# Altium project S12642_0404_etap2.PrjPcb
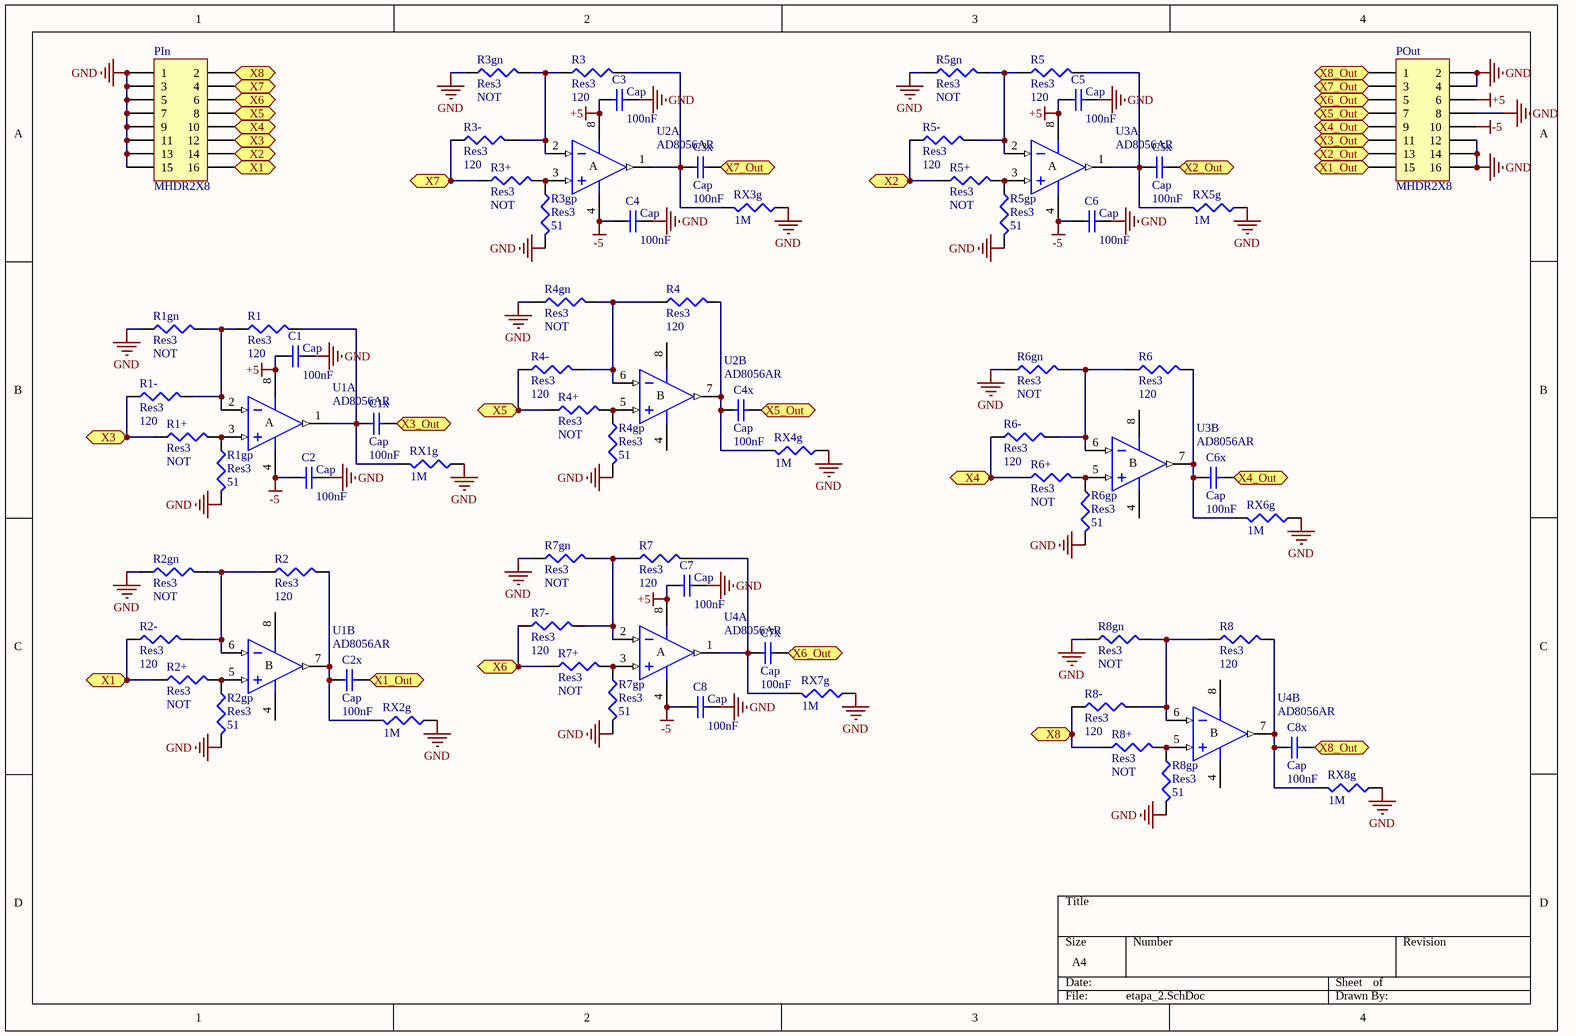
[diagram p0: etapa_2.SchDoc]
1 sheet, 70 parts. Net scope: flat (ports and power ports of the same name join across sheets).
Board file: etapa_2.PcbDoc

## Sheet etapa_2.SchDoc
size A4

### Parts
C1  Cap  value 100nF  [1608[0603]]
C1x  Cap  value 100nF  [1608[0603]]
C2  Cap  value 100nF  [1608[0603]]
C2x  Cap  value 100nF  [1608[0603]]
C3  Cap  value 100nF  [1608[0603]]
C3x  Cap  value 100nF  [1608[0603]]
C4  Cap  value 100nF  [1608[0603]]
C4x  Cap  value 100nF  [1608[0603]]
C5  Cap  value 100nF  [1608[0603]]
C5x  Cap  value 100nF  [1608[0603]]
C6  Cap  value 100nF  [1608[0603]]
C6x  Cap  value 100nF  [1608[0603]]
C7  Cap  value 100nF  [1608[0603]]
C7x  Cap  value 100nF  [1608[0603]]
C8  Cap  value 100nF  [1608[0603]]
C8x  Cap  value 100nF  [1608[0603]]
PIn  MHDR2X8  [MHDR2X8]
POut  MHDR2X8  [MHDR2X8]
R1  Res3  value 120  [0402]
R1+  Res3  value NOT  [0402]
R1-  Res3  value 120  [0402]
R1gn  Res3  value NOT  [0402]
R1gp  Res3  value 51  [0402]
R2  Res3  value 120  [0402]
R2+  Res3  value NOT  [0402]
R2-  Res3  value 120  [0402]
R2gn  Res3  value NOT  [0402]
R2gp  Res3  value 51  [0402]
R3  Res3  value 120  [0402]
R3+  Res3  value NOT  [0402]
R3-  Res3  value 120  [0402]
R3gn  Res3  value NOT  [0402]
R3gp  Res3  value 51  [0402]
R4  Res3  value 120  [0402]
R4+  Res3  value NOT  [0402]
R4-  Res3  value 120  [0402]
R4gn  Res3  value NOT  [0402]
R4gp  Res3  value 51  [0402]
R5  Res3  value 120  [0402]
R5+  Res3  value NOT  [0402]
R5-  Res3  value 120  [0402]
R5gn  Res3  value NOT  [0402]
R5gp  Res3  value 51  [0402]
R6  Res3  value 120  [0402]
R6+  Res3  value NOT  [0402]
R6-  Res3  value 120  [0402]
R6gn  Res3  value NOT  [0402]
R6gp  Res3  value 51  [0402]
R7  Res3  value 120  [0402]
R7+  Res3  value NOT  [0402]
R7-  Res3  value 120  [0402]
R7gn  Res3  value NOT  [0402]
R7gp  Res3  value 51  [0402]
R8  Res3  value 120  [0402]
R8+  Res3  value NOT  [0402]
R8-  Res3  value 120  [0402]
R8gn  Res3  value NOT  [0402]
R8gp  Res3  value 51  [0402]
RX1g  value 1M  [J1-0603]  (hidden comment: Res3)
RX2g  value 1M  [J1-0603]  (hidden comment: Res3)
RX3g  value 1M  [J1-0603]  (hidden comment: Res3)
RX4g  value 1M  [J1-0603]  (hidden comment: Res3)
RX5g  value 1M  [J1-0603]  (hidden comment: Res3)
RX6g  value 1M  [J1-0603]  (hidden comment: Res3)
RX7g  value 1M  [J1-0603]  (hidden comment: Res3)
RX8g  value 1M  [J1-0603]  (hidden comment: Res3)
U1  AD8056AR  [SO-8_M]  (parts A,B of 2)
U2  AD8056AR  [SO-8_M]  (parts A,B of 2)
U3  AD8056AR  [SO-8_M]  (parts A,B of 2)
U4  AD8056AR  [SO-8_M]  (parts A,B of 2)

### Ports
X1 (in), X1 (out), X1_Out (out), X2 (in), X2 (out), X2_Out (out), X3 (in), X3 (out), X3_Out (out), X4 (in), X4 (out), X4_Out (out), X5 (in), X5 (out), X5_Out (out), X6 (in), X6 (out), X6_Out (out), X7 (in), X7 (out), X7_Out (out), X8 (in), X8 (out), X8_Out (out)

### Nets
+5: C1.2 C3.2 C5.2 C7.2 POut.6 U1.8(V+) U2.8(V+) U3.8(V+) U4.8(V+)
-5: C2.2 C4.2 C6.2 C8.2 POut.10 U1.4(V-) U2.4(V-) U3.4(V-) U4.4(V-)
GND: C1.1 C2.1 C3.1 C4.1 C5.1 C6.1 C7.1 C8.1 PIn.1 PIn.3 PIn.5 PIn.7 PIn.9 PIn.11 PIn.13 PIn.15 POut.2 POut.4 POut.8 POut.12 POut.14 POut.16 R1gn.1 R1gp.2 R2gn.1 R2gp.2 R3gn.1 R3gp.2 R4gn.1 R4gp.2 R5gn.1 R5gp.2 R6gn.1 R6gp.2 R7gn.1 R7gp.2 R8gn.1 R8gp.2 RX1g.1 RX2g.1 RX3g.1 RX4g.1 RX5g.1 RX6g.1 RX7g.1 RX8g.1
NetC1x_1: C1x.1 R1.2 RX1g.2 U1.1(OUT)
NetC1x_2: C1x.2 POut.11 ; port X3_Out
NetC2x_1: C2x.1 R2.2 RX2g.2 U1.7(OUT)
NetC2x_2: C2x.2 POut.15 ; port X1_Out
NetC3x_1: C3x.1 R3.2 RX3g.2 U2.1(OUT)
NetC3x_2: C3x.2 POut.3 ; port X7_Out
NetC4x_1: C4x.1 R4.2 RX4g.2 U2.7(OUT)
NetC4x_2: C4x.2 POut.7 ; port X5_Out
NetC5x_1: C5x.1 R5.2 RX5g.2 U3.1(OUT)
NetC5x_2: C5x.2 POut.13 ; port X2_Out
NetC6x_1: C6x.1 R6.2 RX6g.2 U3.7(OUT)
NetC6x_2: C6x.2 POut.9 ; port X4_Out
NetC7x_1: C7x.1 R7.2 RX7g.2 U4.1(OUT)
NetC7x_2: C7x.2 POut.5 ; port X6_Out
NetC8x_1: C8x.1 R8.2 RX8g.2 U4.7(OUT)
NetC8x_2: C8x.2 POut.1 ; port X8_Out
NetPIn_2: PIn.2 R8+.1 R8-.1 ; port X8
NetPIn_4: PIn.4 R3+.1 R3-.1 ; port X7
NetPIn_6: PIn.6 R7+.1 R7-.1 ; port X6
NetPIn_8: PIn.8 R4+.1 R4-.1 ; port X5
NetPIn_10: PIn.10 R6+.1 R6-.1 ; port X4
NetPIn_12: PIn.12 R1+.1 R1-.1 ; port X3
NetPIn_14: PIn.14 R5+.1 R5-.1 ; port X2
NetPIn_16: PIn.16 R2+.1 R2-.1 ; port X1
NetR1+_2: R1+.2 R1gp.1 U1.3(IN+)
NetR1_1: R1.1 R1-.2 R1gn.2 U1.2(IN-)
NetR2+_2: R2+.2 R2gp.1 U1.5(IN+)
NetR2_1: R2.1 R2-.2 R2gn.2 U1.6(IN-)
NetR3+_2: R3+.2 R3gp.1 U2.3(IN+)
NetR3_1: R3.1 R3-.2 R3gn.2 U2.2(IN-)
NetR4+_2: R4+.2 R4gp.1 U2.5(IN+)
NetR4_1: R4.1 R4-.2 R4gn.2 U2.6(IN-)
NetR5+_2: R5+.2 R5gp.1 U3.3(IN+)
NetR5_1: R5.1 R5-.2 R5gn.2 U3.2(IN-)
NetR6+_2: R6+.2 R6gp.1 U3.5(IN+)
NetR6_1: R6.1 R6-.2 R6gn.2 U3.6(IN-)
NetR7+_2: R7+.2 R7gp.1 U4.3(IN+)
NetR7_1: R7.1 R7-.2 R7gn.2 U4.2(IN-)
NetR8+_2: R8+.2 R8gp.1 U4.5(IN+)
NetR8_1: R8.1 R8-.2 R8gn.2 U4.6(IN-)

### Notes on the sheet
- (in symbol AD8056AR, part A) A
- (in symbol AD8056AR, part B) B

### Library data of the parts
C1 C1x C2 C2x C3 C3x C4 C4x C5 C5x C6 C6x C7 C7x C8 C8x = Cap: Capacitor; Published: 8-Jun-2000; LatestRevisionDate: 17-Jul-2002; LatestRevisionNote: Re-released for DXP Platform.; PackageReference: RAD-0.3; Publisher: Altium Limited; PackageDescription: Radial Cap, Thru-Hole; 2 Leads; 0.3 in Pin Spacing
PIn POut = MHDR2X8: Header, 8-Pin, Dual row; LatestRevisionDate: 17-Jul-2002; LatestRevisionNote: Re-released for DXP Platform.; Publisher: Altium Limited
R1 R1+ R1- R1gn R1gp R2 R2+ R2- R2gn R2gp R3 R3+ R3- R3gn R3gp R4 R4+ R4- R4gn R4gp R5 R5+ R5- R5gn R5gp R6 R6+ R6- R6gn R6gp R7 R7+ R7- R7gn R7gp R8 R8+ R8- R8gn R8gp RX1g RX2g RX3g RX4g RX5g RX6g RX7g RX8g = Res3: Resistor; Published: 8-Jun-2000; LatestRevisionDate: 29-May-2009; LatestRevisionNote: IPC-7351 Footprint Added.; PackageReference: J1-0603; Publisher: Altium Limited; PackageDescription: Chip Resistor
U1-U4 = AD8056AR: Low Cost, 300MHz Voltage Feedback Amplifier; Published: 8-Jun-2000; LatestRevisionDate: 13-Apr-2006; LatestRevisionNote: IPC-7351 Footprint Added.; DatasheetVersion: REV. 0 1997; PackageVersion: revA; PackageReference: SO-8; Publisher: Altium Limited; PackageDescription: 8-Pin Small Outline Integrated Circuit 1.27 mm Pitch; Code_JEDEC: MS-012-AA; Code_IPC: SOIC127P600-8; ComponentLink1Description: Manufacturer Link; ComponentLink1URL: http://www.analog.com/en/prod/0,,759_786_AD8055%2C00.html; ComponentLink2Description: Datasheet; ComponentLink2URL: http://www.analog.com/UploadedFiles/Data_Sheets/40402558757264AD8055_6_i.pdf